# EAGLE schematic MAX3232_zapojenie (EAGLE 9.6.2)
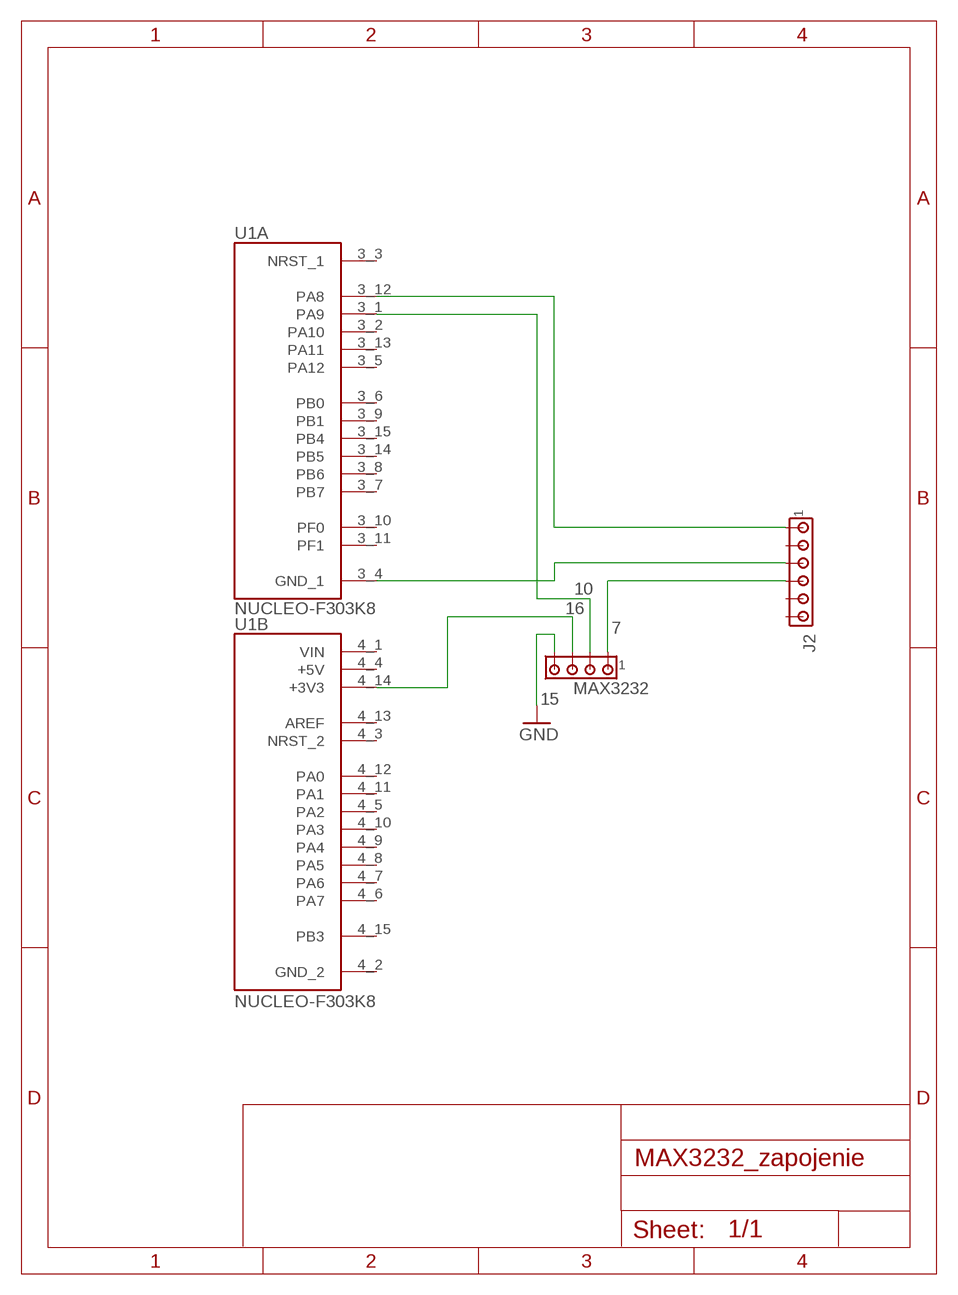
[diagram p0: schematic, sheet 1]

## Parts
J2  MTA06-100  [10X06MTA]
MAX3232  MTA04-100  [10X04MTA]
U1  NUCLEO-F303K8  [MODULE_NUCLEO-F303K8]

## Nets
7: J2.4 MAX3232.1
10: MAX3232.2 U1.3_1(A:PA9)
15: MAX3232.4 ; supply symbol labelled GND
16: MAX3232.3 U1.4_14(B:+3V3)
N$1: J2.1 U1.3_12(A:PA8)
N$2: J2.3 U1.3_4(A:GND_1)
Unconnected: J2.2 J2.5 J2.6 U1.3_2(A:PA10) U1.3_3(A:NRST_1) U1.3_5(A:PA12) U1.3_6(A:PB0) U1.3_7(A:PB7) U1.3_8(A:PB6) U1.3_9(A:PB1) U1.3_10(A:PF0) U1.3_11(A:PF1) U1.3_13(A:PA11) U1.3_14(A:PB5) U1.3_15(A:PB4) U1.4_3(B:NRST_2) U1.4_5(B:PA2) U1.4_6(B:PA7) U1.4_7(B:PA6) U1.4_8(B:PA5) U1.4_9(B:PA4) U1.4_10(B:PA3) U1.4_11(B:PA1) U1.4_12(B:PA0) U1.4_13(B:AREF) U1.4_15(B:PB3)

## Power pins joined to a net without a drawn wire
+5V: U1.4_4(B:+5V)
GND_2: U1.4_2(B:GND_2)
VIN: U1.4_1(B:VIN)

## Library data of the parts
J2 = con-amp:MTA06-100: AMP connector Connection corrected 2014-09-19
MAX3232 = con-amp:MTA04-100: AMP connector
U1 = NUCLEO-F303K8 Model:NUCLEO-F303K8: Check availability <https://pricing.snapeda.com/parts/NUCLEO-F303K8/STMicroelectronics/view-part?ref=eda>; AVAILABILITY: In Stock; CHECK_PRICES: https://www.snapeda.com/parts/NUCLEO-F303K8/STMicroelectronics/view-part/?ref=eda; DESCRIPTION: STM32F303K8, mbed-Enabled Development Nucleo-32 STM32F3 ARM® Cortex®-M4 MCU 32-Bit Embedded Evaluation Board; MF: STMicroelectronics; MP: NUCLEO-F303K8; PACKAGE: None; PRICE: None; PURCHASE-URL: https://www.snapeda.com/api/url_track_click_mouser/?unipart_id=276791&manufacturer=STMicroelectronics&part_name=NUCLEO-F303K8&search_term=nucleo; SNAPEDA_LINK: https://www.snapeda.com/parts/NUCLEO-F303K8/STMicroelectronics/view-part/?ref=snap

## Module MAX3232_MODULE
Ports: 

### Library data of the parts